# EAGLE design T14_V2_METROKNOME (EAGLE 6.1)
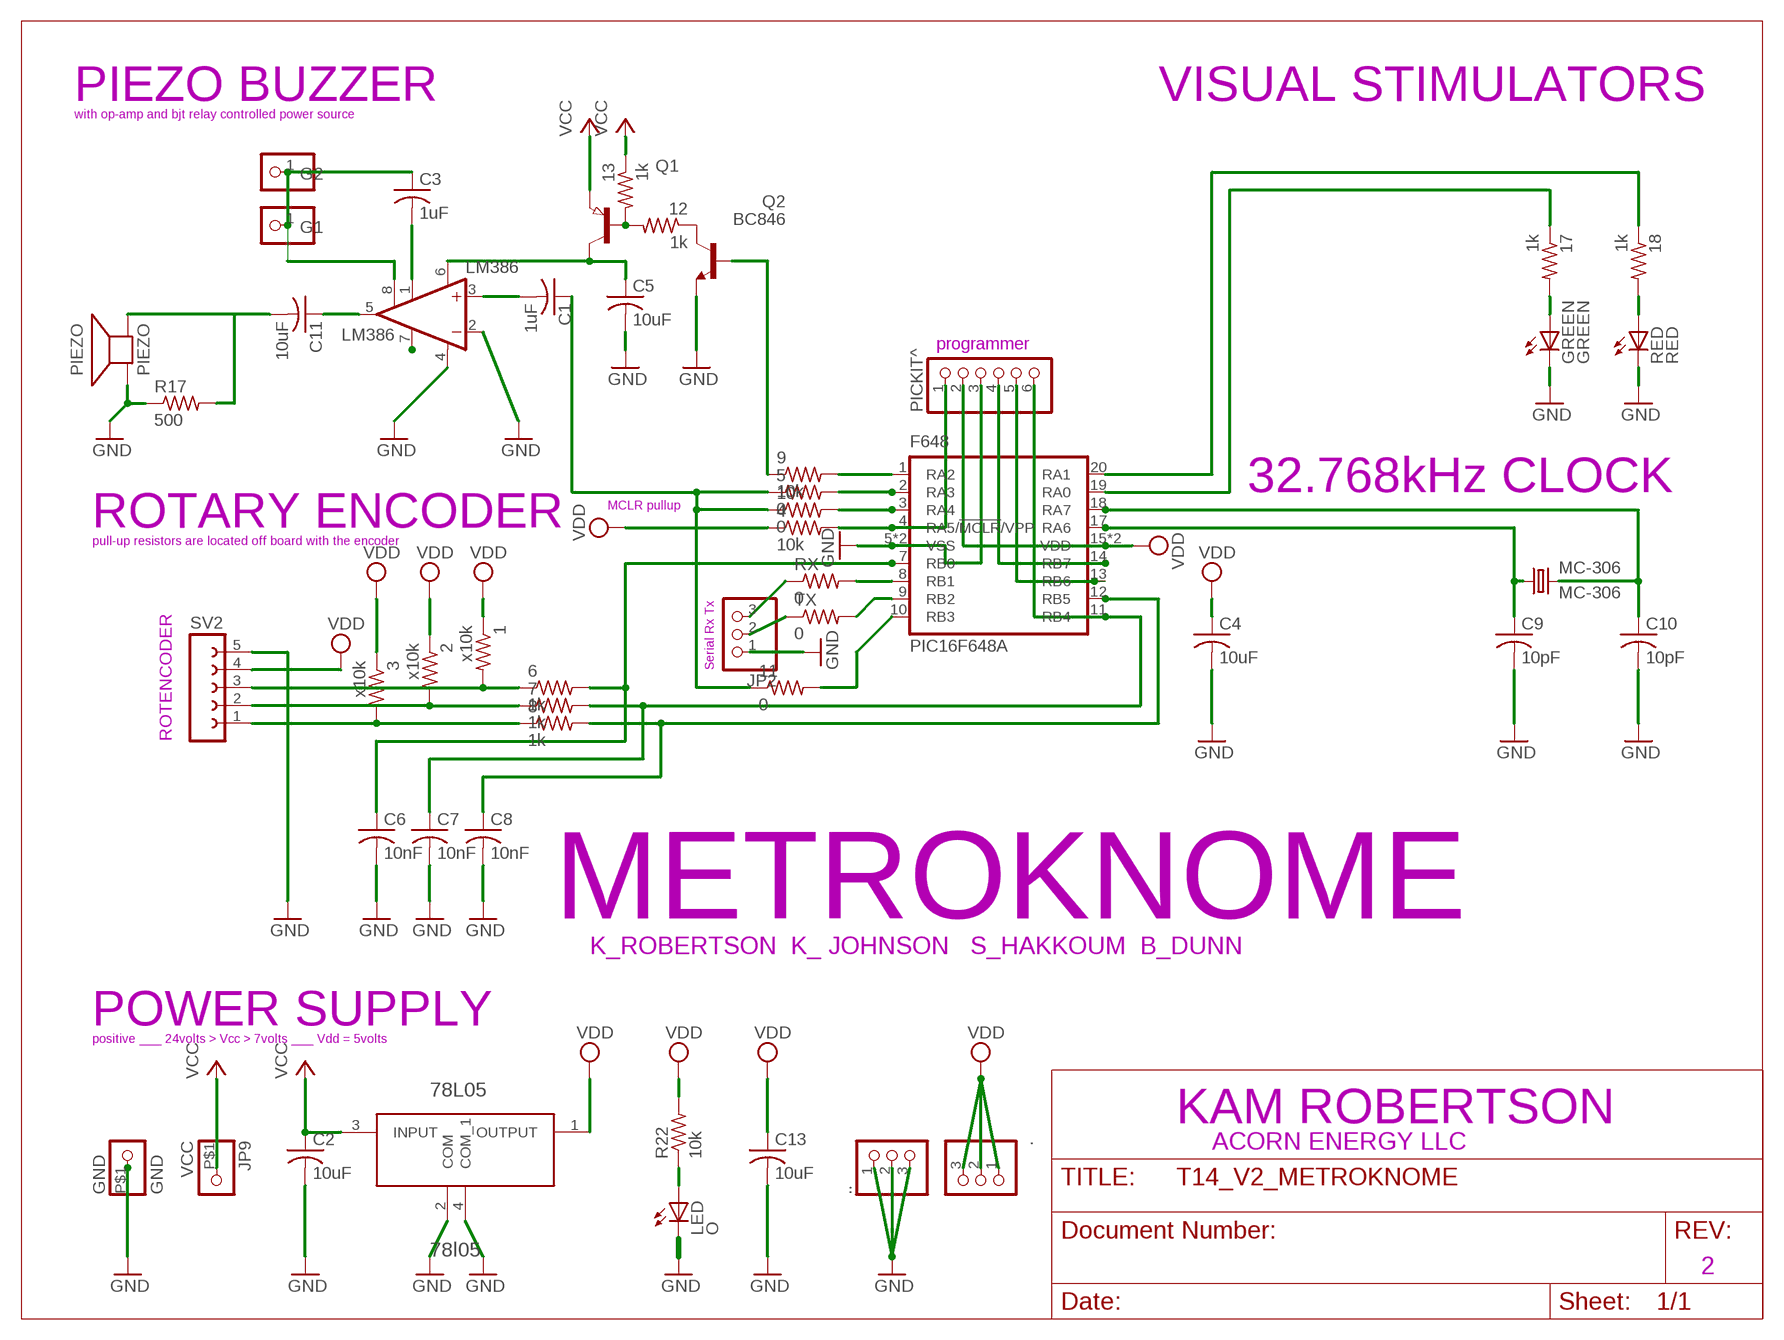
[diagram p0: schematic, sheet 1]

## Parts
1  x10k  R-US_R0603  [R0603]
2  x10k  R-US_R0603  [R0603]
3  x10k  R-US_R0603  [R0603]
4  10k  R-US_R1206  [R1206]
5  0  R-US_R0603  [R0603]
6  1k  R-US_R1206  [R1206]
7  1k  R-US_R1206  [R1206]
8  1k  R-US_R1206  [R1206]
9  10k  R-US_R1206  [R1206]
10  0  R-US_R0603  [R0603]
11  0  R-US_R1206  [R1206]
12  1k  R-US_R1206  [R1206]
13  1k  R-US_R1206  [R1206]
17  1k  R-US_R1206  [R1206]
18  1k  R-US_R1206  [R1206]
78L05  78l05  UA78L05ACPKG3  [SOT150P400X160-4N]
.  PINHD-1X3CB  [1X03-CLEANBIG]
..  PINHD-1X3CB  [1X03-CLEANBIG]
C1  1uF  C-USC1210  [C1210]
C2  10uF  C-USC1210  [C1210]
C3  1uF  C-USC1210  [C1210]
C4  10uF  C-USC1210  [C1210]
C5  10uF  C-USC1210  [C1210]
C6  10nF  C-USC1210  [C1210]
C7  10nF  C-USC1210  [C1210]
C8  10nF  C-USC1210  [C1210]
C9  10pF  C-USC1210  [C1210]
C10  10pF  C-USC1210  [C1210]
C11  10uF  C-USC1210  [C1210]
C13  10uF  C-USC1210  [C1210]
F648  PIC16F648A  PIC16F1826/27SS  [SSOP20]
G1  PINHD-1X1CB  [1X01-CLEANBIG]
G2  PINHD-1X1CB  [1X01-CLEANBIG]
GND  GND  PINHD-1X1-BIGPOGO  [1X1-BIGPOGO]
GREEN  GREEN  LED5MM  [LED5MM]
JP2  PINHD-1X3CB  [1X03-CLEANBIG]
JP9  VCC  PINHD-1X1-BIGPOGO  [1X1-BIGPOGO]
LED  O  LEDCHIPLED_1206  [CHIPLED_1206]
LM386  LM386  LM386M-1  [SO08]
MC-306  MC-306  [MC-306]
PICKIT^  PINHD-1X6LOCK  [1X06-BIGLOCK]
PIEZO  PIEZO  SPEAKER/PS12  [PS12]
Q1  PNP-TRANSISTOR_SOT89  [SOT89]
Q2  BC846  [SOT23]
R17  500  R-US_R1206  [R1206]
R22  10k  R-US_R1206  [R1206]
RED  RED  LED5MM  [LED5MM]
RX  0  R-US_R1206  [R1206]
SV2  FE05-1  [FE05-1]
TX  0  R-US_R1206  [R1206]

## Nets
GND: 78L05.2(COM) 78L05.4(COM_1) ...1 ...2 ...3 C2.2 C4.2 C5.2 C6.2 C7.2 C8.2 C9.2 C10.2 C13.2 F648.5(VSS) F648.6(VSS) GND.P$1 GREEN.K(C) JP2.1 LED.C LM386.2(-IN) LM386.4(GND) PICKIT^.3 PIEZO.P$2(-) Q2.2(E) R17.1 RED.K(C) SV2.5
N$1: 9.2 F648.1(RA2)
N$2: C3.2 LM386.1(GAIN)
N$3: 9.1 Q2.1(B)
N$4: 5.2 F648.2(RA3)
N$5: 4.2 F648.4(RA5/!MCLR!/VPP) PICKIT^.1
N$6: 6.2 C6.1 F648.7(RB0)
N$7: JP2.3 RX.1
N$8: 8.2 C8.1 F648.12(RB5)
N$9: 10.2 F648.3(RA4)
N$10: 11.2 F648.10(RB3)
N$11: 12.1 Q2.3(C)
N$12: 12.2 13.2 Q1.1(B)
N$13: C3.1 G1.1 G2.1 LM386.8(GAIN)
N$14: 1.2 6.1 SV2.3
N$15: 2.2 7.1 SV2.2
N$16: 3.2 8.1 SV2.1
N$17: JP2.2 TX.1
N$18: 17.1 F648.19(RA0)
N$19: 18.1 F648.20(RA1)
N$20: 7.2 C7.1 F648.11(RB4) PICKIT^.6
N$21: F648.9(RB2) TX.2
N$22: F648.14(RB7) PICKIT^.4
N$23: F648.8(RB1) RX.2
N$24: F648.13(RB6) PICKIT^.5
N$28: 18.2 RED.A
N$29: 17.2 GREEN.A
N$31: C9.1 F648.17(RA6) MC-306.1
N$35: C1.2 LM386.3(+IN)
N$36: C11.1 LM386.5(OUT)
N$37: C10.1 F648.18(RA7) MC-306.4
N$39: C11.2 PIEZO.P$1(+) R17.2
N$40: LED.A R22.1
N$85: 5.1 10.1 11.1 C1.1
N$102: LM386.7(BYPASS)
VCC: 13.1 78L05.3(INPUT) C2.1 JP9.P$1 Q1.3(E)
VDD: 1.1 2.1 3.1 4.1 78L05.1(OUTPUT) ..1 ..2 ..3 C4.1 C13.1 F648.15(VDD) F648.16(VDD) PICKIT^.2 R22.2 SV2.4
VS: C5.1 LM386.6(VS) Q1.2(C)

## Notes on the sheet
- PIEZO BUZZER | VISUAL STIMULATORS
- with op-amp and bjt relay controlled power source
- programmer
- 32.768kHz CLOCK
- MCLR pullup
- ROTARY ENCODER
- pull-up resistors are located off board with the encoder
- Serial Rx Tx
- ROTENCODER
- METROKNOME
- K_ROBERTSON  K_ JOHNSON   S_HAKKOUM  B_DUNN
- POWER SUPPLY
- positive ___ 24volts > Vcc > 7volts ___ Vdd = 5volts
- KAM ROBERTSON
- ACORN ENERGY LLC
- 2

## Library data of the parts
1-13 17 18 R17 R22 RX TX = resistor:R-US_: RESISTOR, American symbol
78L05 = TI-Eagle_library:UA78L05: μA78L00 SERIES POSITIVE-VOLTAGE REGULATORS,SOT-89-3; MPN: UA78L05ACPKG3; OC_FARNELL: 1236590; OC_NEWARK: 13M5626; PACKAGE: SOT-89-3; SUPPLIER: TEXAS INSTRUMENTS
. .. JP2 = adafruit:PINHD-1X3: PIN HEADER
C1-C11 C13 = adafruit:C-US: CAPACITOR, American symbol
F648 = microchip:PIC16*F1826/27: 18/20/28-Pin Flash Microcontrollers with nanoWatt XLP Technology Source: www.microchip.com PIC16F1827.pdf
G1 G2 GND JP9 = adafruit:PINHD-1X1: Pin header 1x1 for 0.1" spacing With round pins
GREEN LED RED = adafruit:LED: LED OSRAM: - CHIPLED LG R971, LG N971, LY N971, LG Q971, LY Q971, LO R971, LY R971 LH N974, LH R974 LS Q976, LO Q976, LY Q976 LO Q996 - Hyper CHIPLED LW Q18S LB Q993, LB Q99A, LB R99A - SideLED LS A670, LO A670, LY A670, LG A670, LP A670 LB A673, LV A673, LT A673, LW A673 LH A674 LY A675 LS A676, LA A676, LO A676, LY A676, LW A676 LS A679, LY A679, LG A679 - Hyper Micro SIDELED® LS Y876, LA Y876, LO Y876, LY Y876 LT Y87S - SmartLED LW L88C, LW L88S LB L89C, LB L89S, LG L890 LS L89K, LO L89K, LY L89K LS L896, LA L896, LO L896, LY L896 - TOPLED LS T670, LO T670, LY T670, LG T670, LP T670 LSG T670, LSP T670, LSY T670, LOP T670, LYG T670 LG T671, LOG T671, LSG T671 LB T673, LV T673, LT T673, LW T673 LH T674 LS T676, LA T676, LO T676, LY T676, LB T676, LH T676, LSB T676, LW T676 LB T67C, LV T67C, LT T67C, LS T67K, LO T67K, LY T67K, LW E67C LS E67B, LA E67B, LO E67B, LY E67B, LB E67C, LV E67C, LT E67C LW T67C LS T679, LY T679, LG T679 LS T770, LO T770, LY T770, LG T770, LP T770 LB T773, LV T773, LT T773, LW T773 LH T774 LS E675, LA E675, LY E675, LS T675 LS T776, LA T776, LO T776, LY T776, LB T776 LHGB T686 LT T68C, LB T68C - Hyper Mini TOPLED® LB M676 - Mini TOPLED Santana® LG M470 LS M47K, LO M47K, LY M47K Source: http://www.osram.convergy.de/
LM386 = linear:LM386?-*: Low Voltage Audio Power Amplifier Source: http://cache.national.com/ds/LM/LM386.pdf
MC-306 = crystal:MC-306: kHz RANGE CRYSTAL UNIT SMD Source: MC-306_405_406_E07X.PDF Homepage <http://www.epsontoyocom.co.jp>; MPN: MC-306 60.0KHZ 100PPM ,12.5PF; OC_FARNELL: 1278040; OC_NEWARK: 31M5576
PICKIT^ = adafruit:PINHD-1X6: PIN HEADER
PIEZO = adafruit:SPEAKER: SPEAKER Source: Buerklin Added PS12 (for part # PS1240 piezo) http://www.ladyada.net/library/pcb/eaglelibrary.html
Q1 = semicon-smd-ipc:PNP-TRANSISTOR_: PNP TRANSISTOR
Q2 = transistor-neu-to92:BC846: NPN TRANSISTOR
SV2 = con-lsta:FE05-1: FEMALE HEADER; OC_FARNELL: unknown; OC_NEWARK: unknown

## Board
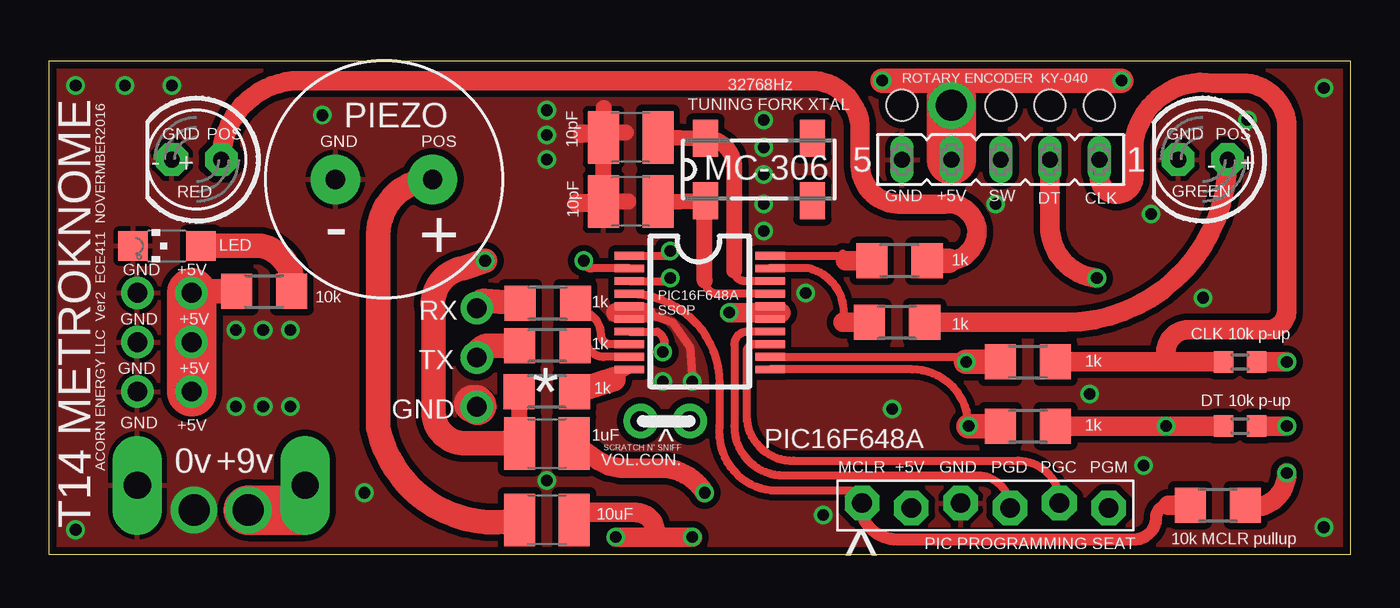
[diagram p1: board, top side]
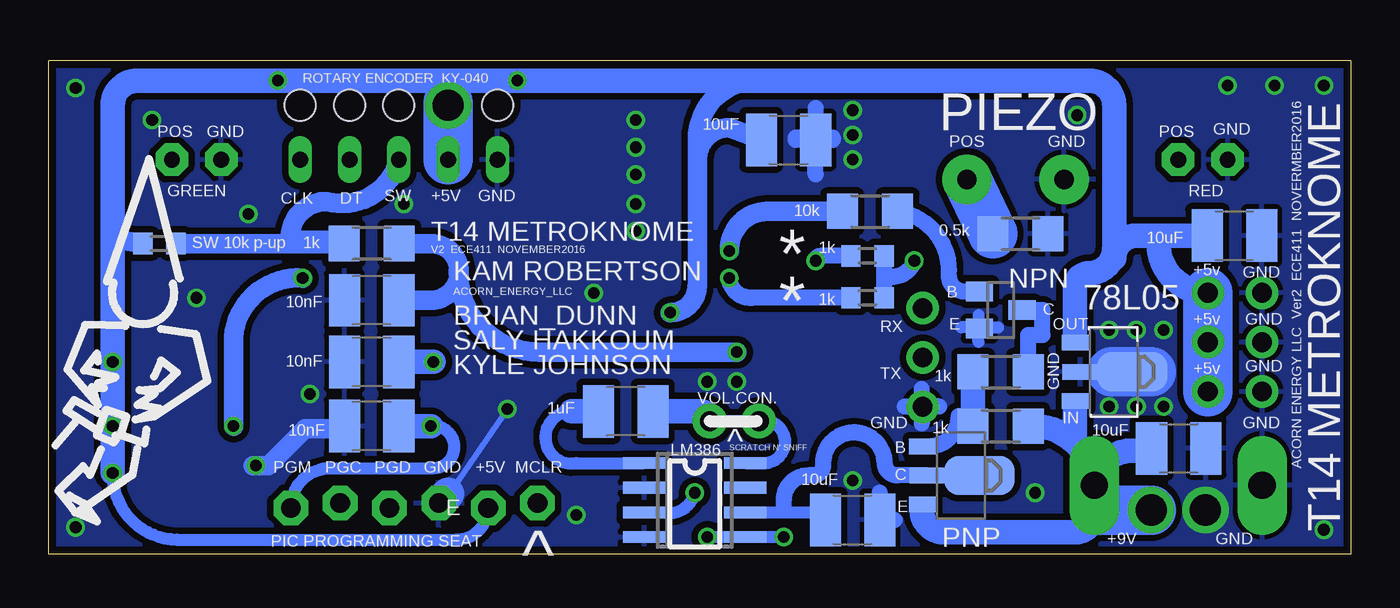
[diagram p2: board, bottom side, seen from below]

Size 67.06 x 25.4 mm. Coordinates in mm from the lower left corner, seen from the top.
Outline: 0,0 0,25.4 67.06,25.4 67.06,0 0.01,0
Copper layers (1*16): Top 0.0356mm / dielectric 1.5011mm / Bottom 0.0356mm
Design rules: minimum track width 13mil, minimum drill 13mil, track to track 13mil, track to pad 13mil, pad to pad 13mil, via to via 13mil, smd to smd 13mil, copper to edge 15mil, drill to drill 6mil, minimum pad ring 7mil, minimum via ring 7mil, stop-mask expansion 2.5mil, vias tented up to drill 0mil, thermal gap 10mil
Holes 1.6 mm at 49.02,23.11 51.56,23.11 54.1,23.11 43.94,23.11

### Footprints (pad centres in the part's own frame; a part is rotated, then mirrored left to right if it is on the bottom)
R0603 = smd 1 x 1.1: 1 -0.85,0; 2 0.85,0
R1206 = smd 1.6 x 1.803: 1 -1.422,0; 2 1.422,0
SOT150P400X160-4N = smd 0.8 x 1.4: 1 -1.499,-1.981; 3 1.499,-1.981 | smd 0.8 x 1.9: 2 0,-1.727 | smd 2.032 x 3.65: 4 0,0.94
1X03-CLEANBIG = drill 1.016 pad 1.676: 1 -2.54,0; 2 0,0; 3 2.54,0
C1210 = smd 1.6 x 2.7: 1 -1.4,0; 2 1.4,0
SSOP20 = smd 0.4 x 1.5: 1 -2.925,-3.625; 2 -2.275,-3.625; 3 -1.625,-3.625; 4 -0.975,-3.625; 5 -0.325,-3.625; 6 0.325,-3.625; 7 0.975,-3.625; 8 1.625,-3.625; 9 2.275,-3.625; 10 2.925,-3.625; 11 2.925,3.625; 12 2.275,3.625; 13 1.625,3.625; 14 0.975,3.625; 15 0.325,3.625; 16 -0.325,3.625; 17 -0.975,3.625; 18 -1.625,3.625; 19 -2.275,3.625; 20 -2.925,3.625
1X01-CLEANBIG = drill 1.016 pad 1.778: 1 0,0
1X1-BIGPOGO = drill 1.4 pad 2.54 long: P$1 0,0
LED5MM = drill 0.813 pad 1.676 octagon: A -1.27,0; K 1.27,0
CHIPLED_1206 = smd 1.5 x 1.5: A 0,-1.75; C 0,1.75
SO08 = smd 0.6 x 2.2: 1 -1.905,-2.6; 2 -0.635,-2.6; 3 0.635,-2.6; 4 1.905,-2.6; 5 1.905,2.6; 6 0.635,2.6; 7 -0.635,2.6; 8 -1.905,2.6
MC-306 = smd 1.3 x 1.9: 1 -2.75,-1.6; 2 2.75,-1.6; 3 2.75,1.6; 4 -2.75,1.6
1X06-BIGLOCK = drill 1.016 pad 1.778 octagon: 1 -6.35,0.127; 2 -3.81,-0.127; 3 -1.27,0.127; 4 1.27,-0.127; 5 3.81,0.127; 6 6.35,-0.127
PS12 = drill 1 pad 2.54: P$1 -2.5,0; P$2 2.5,0
SOT89 = smd 0.8 x 1.4: 1 -1.499,-1.981; 3 1.499,-1.981 | smd 0.8 x 1.9: 2 0,-1.727 | smd 2.032 x 3.65: 2@1 0,0.94
SOT23 = smd 1 x 1.4: 1 -0.95,-1.1; 2 0.95,-1.1; 3 0,1.1
FE05-1 = drill 0.813 long: 1 -5.08,0; 2 -2.54,0; 3 0,0; 4 2.54,0; 5 5.08,0

### Placement (x,y rotation side)
1  61.34,16 0 bottom
2  61.34,6.6 180 top
3  61.34,9.91 180 top
4  60.2,2.54 180 top
5  24.89,15.37 180 bottom
6  50.42,16 0 bottom
7  50.42,6.6 180 top
8  50.42,9.91 180 top
9  24.77,17.65 180 bottom
10  24.89,13.21 180 bottom
11  25.65,8.38 0 top
12  18.03,9.4 180 bottom
13  18.03,6.6 180 bottom
17  43.69,11.94 0 top
18  43.81,15.11 0 top
78L05  12.19,9.4 270 bottom
.  7.37,10.92 90 top
..  4.57,10.92 270 top
C1  25.65,5.71 0 top
C2  8.86,5.46 0 bottom
C3  37.34,7.37 180 bottom
C4  28.96,21.34 0 bottom
C5  25.65,1.78 0 bottom
C6  50.42,13.08 180 bottom
C7  50.42,6.6 180 bottom
C8  50.42,9.91 180 bottom
C9  29.97,18.16 180 top
C10  29.97,21.46 180 top
C11  25.65,1.78 180 top
C13  5.99,16.41 0 bottom
F648  33.53,12.45 270 top
G1  33.02,6.86 180 bottom
G2  30.48,6.86 180 bottom
GND  4.57,3.56 270 bottom
GREEN  59.44,20.32 180 top
JP2  22.05,10.13 90 top
JP9  13.21,3.56 90 bottom
LED  6.1,15.88 90 top
LM386  33.78,2.79 270 bottom
MC-306  36.58,19.81 0 top
PICKIT^  48.23,2.51 0 top
PIEZO  17.27,19.3 180 top
Q1  20.07,4.06 270 bottom
Q2  18.03,12.57 270 bottom
R17  17.02,16.51 180 bottom
R22  11.1,13.54 180 top
RED  7.62,20.32 180 top
RX  25.7,12.93 0 top
SV2  49.02,20.32 180 top
TX  25.68,10.74 0 top

### Tracks (layer width: path | path; a pad name or v marks a point on that pad's centre or on a via)
GND  (via drill 0.6, 1.6)
  Top 0.254: 29.58,12.45 arc90 F648.6
  Top 0.406: 29.58,12.45 arc90 F648.5 | 30.73,12.45 32.13,11.94 33.02,10.67 v33.15,8.89
  Top 0.813: 28.57,22.99 28.57,21.59 | C9.2 28.57,18.03 27.18,18.03 27.18,18.16 C9.2 | 29.84,18.16 C9.2 | C9.2 28.57,21.59 | 28.57,21.59 27.43,21.59 27.43,21.72 29.72,21.72
  Top 1.016: 29.21,12.45 29.58,12.45 30.73,12.45
  Top 1.93: 22.1,7.62 arc90 21.97,7.75 21.84,7.75
  Bottom 0.305: v43.43,7.49 46.48,3.05
  Bottom 0.61: 19.18,12.32 19.18,11.68 | 19.18,10.92 19.18,11.68 | 19.18,11.68 20.07,11.68 | 19.18,11.68 18.16,11.68 | 46.48,3.05 arc291 46.48,3.12
  Bottom 0.813: 27.56,22.99 C4.2 | 27.56,19.56 C4.2 | C4.2 28.57,21.34 C10.2 26.67,21.46 26.67,21.34 | 22.99,7.62 22.1,7.62 | 21.21,7.62 22.1,7.62 | 22.1,7.62 22.1,8.51 | 22.1,7.62 22.1,6.73 | 23.5,1.78 C5.2 24.26,3.17 | JP2.1 22.1,7.62
  Bottom 1.016: Q2.2 arc90 19.18,11.67 19.18,11.68 | C7.2 51.95,6.48 53.85,6.48 55.75,4.57 v56.39,4.57 56.52,4.57
  Bottom 1.676: PICKIT^.3 46.48,3.12 46.99,2.67
  Bottom 2.54: 10.29,9.4 12.32,9.4
  other vias: 65.66,1.4 65.66,24 1.4,1.27 1.4,24.13 61.72,22.35 6.35,24.13 53.59,8.26 39.88,2.03 59.44,13.21 36.83,16.64 36.83,18.03 36.83,19.56 36.83,20.95 36.83,22.35 56.77,17.53 38.99,13.46 14.1,22.61 25.65,22.86 25.65,21.59 25.65,20.32 11.05,11.56 9.65,11.56 12.45,11.56 9.65,7.62 11.05,7.62 12.45,7.62 31.62,8.89 16.26,3.17 25.65,3.81 48.77,18.03 3.94,24.13 7.49,2.29
  pour Top: 0.38,25.15 0.38,0.25 66.8,0.25 66.8,25.15
  pour Bottom: 0.38,25.02 0.38,0.13 66.8,0.25 66.8,25.15
N$1  (via drill 0.6)
  Top 0.406: F648.1 31.63,15.37 arc90 v32,15.62
  Bottom 1.016: 26.16,17.65 9.2 30.1,17.65 arc-90 v32,15.62
N$2
  Bottom 0.61: 40.13,7.37 arc-191 39.88,4.7 LM386.1
  Bottom 1.27: C3.2 40.13,7.37
N$3
  Bottom 0.813: Q2.1 19.87,13.52 arc90 20.7,14.35 arc-90 23.5,17.65 9.1
N$4  (via drill 0.6)
  Top 0.406: F648.2 27.95,14.72 arc-90 v27.56,15.11
  Bottom 0.813: 5.2 27.3,15.37 arc-90 v27.56,15.11
N$5
  Top 0.406: F648.4 arc-90 34.54,8.78 34.54,6.6 arc90 37.21,3.3 41.15,3.3 arc-90 41.78,2.67 arc90 41.81,2.64 PICKIT^.1
  Top 0.61: 57.66,2.54 arc90 57.02,1.91 arc-90 55.88,0.76 43.69,0.76 arc-90 41.78,2.67
  Top 1.016: 4.2 57.66,2.54
N$6  (via drill 0.6)
  Top 0.406: F648.7 31.33,11.47 arc-90 v31.62,10.41
  Bottom 0.254: 45.97,14.61 arc-90 47.37,16
  Bottom 1.016: 6.2 47.37,16 arc180 47.37,13.08 C6.1 | v31.62,10.41 41.78,10.41 arc90 45.97,14.61
N$7
  Top 1.27: RX.1 22.45,13.06 arc90 22.1,12.7 22.1,12.62 | 22.1,12.57 22.1,12.62 | 22.1,12.62 arc90 JP2.3
N$8  (via drill 0.6)
  Top 0.406: v47.24,9.91 46.99,10.16 37.21,10.16 37.2,10.17 F648.12
  Top 1.27: 8.2 v47.24,9.91
  Bottom 1.27: v47.24,9.91 C8.1
N$9  (via drill 0.6)
  Top 0.406: F648.3 31.72,14.07 arc90 v32,14.22
  Bottom 0.813: 25.78,13.21 10.2 30.86,13.21 arc90 v32,14.22
N$10
  Top 0.406: 29.08,9.02 F648.10
  Top 1.27: 11.2 29.08,9.02
N$11
  Bottom 0.813: 12.1 16.61,11.3 15.88,11.3 15.88,12.57 16.89,12.57
  Bottom 1.016: Q2.3 16.89,12.57
N$12
  Bottom 0.406: 13.2 19.43,6.6
  Bottom 0.813: Q1.1 21.74,5.56 arc-90 20.19,7.11 19.94,7.11 | 19.94,7.11 arc90 19.43,6.6 | 19.94,7.11 19.46,7.11
  Bottom 1.27: 19.46,7.11 12.2
N$13
  Top 0.61: G1.1 30.61,6.86
  Bottom 0.61: G1.1 G2.1 arc193 30.23,4.7 LM386.8
  Bottom 1.27: C3.1 33.53,7.37 arc90 G1.1
N$14
  Bottom 0.61: 54.61,16.38 52.09,16.38 arc90 6.1
  Bottom 1.016: 1.2 6.1 | 54.61,16.38 arc90 52.7,18.16 arc-90 SV2.3
N$15  (via drill 0.6)
  Top 1.016: 2.2 v57.53,6.6 7.1 | 7.1 51.82,6.6 arc-90 51.94,6.48 51.94,6.5 arc90 7.1 | SV2.2 51.56,17.14 arc90 v53.98,14.22
  Bottom 1.016: v53.98,14.22 arc-90 57.53,11.18 v57.53,6.6
N$16
  Top 1.016: 3.2 57.53,9.91 | 57.53,9.91 8.1 | 57.53,9.91 57.53,10.41 arc-90 58.67,11.56 62.74,11.56 arc90 63.75,12.57 63.75,21.97 arc90 61.47,24.26 59.94,24.26 arc90 55.88,21.21 55.88,19.43 arc-180 54.1,19.43 SV2.1
N$17
  Top 1.27: TX.1 22.66,10.74 arc90 JP2.2
N$18
  Top 0.406: 40.89,11.94 arc90 39.12,14.73 37.16,14.73 arc90 F648.19
  Top 1.016: 17.1 40.89,11.94
N$19
  Top 0.406: F648.20 arc90 F648.20 40.64,15.37 arc90 41.02,15.11 40.89,15.49
  Top 1.016: 18.1 41.02,15.11
N$20  (via drill 0.6)
  Top 0.406: v47.37,6.6 arc90 44.45,9.52 F648.11
  Top 1.27: v47.37,6.6 7.2
  Bottom 0.61: PICKIT^.6 arc90 52.53,4.45 47.24,4.45 arc-187 v47.37,6.6
  Bottom 1.27: C7.1 v47.37,6.6
N$21
  Top 0.406: F648.9 28.56,10.17 arc-90 27.69,11.05 27.41,11.05 arc90 TX.2
N$22
  Top 0.406: PICKIT^.4 arc90 47.83,4.06 37.85,4.06 arc-90 35.31,6.6 35.31,10.79 arc-90 35.98,11.47 F648.14
N$23
  Top 0.406: 27.18,12.57 arc-90 28.45,11.3 arc90 28.93,10.82 F648.8 | 27.18,12.57 27.18,12.45 | 27.18,12.57 27.15,12.57 arc90 RX.2
N$24
  Top 0.406: F648.13 36.35,10.82 arc90 35.94,10.41 35.94,7.11 arc90 38.35,4.83 49.91,4.83 arc-90 52.07,2.67 | 52.07,2.67 52.07,2.54 | 52.07,2.67 arc90 PICKIT^.5
N$28
  Top 1.016: RED.A arc-90 12.95,24.38 39.24,24.38 arc-90 41.78,21.84 41.78,20.07 arc90 43.81,18.03 46.1,18.03 arc-188 46.35,15.11
  Top 1.27: 18.2 46.35,15.11
N$29
  Top 1.016: 17.2 52.32,11.94 arc90 GREEN.A
N$31
  Top 0.406: F648.17 34.46,13.42 arc-90 33.78,14.1 | MC-306.1 MC-306.1 arc-90 33.78,18.16
  Top 0.813: 33.78,14.1 33.78,18.16 | C9.1 MC-306.1
N$35  (via drill 0.6)
  Top 0.61: C1.2
  Top 1.016: v33.78,3.17 arc61 31.37,4.45 29.46,4.45 28.83,4.57 28.32,4.83 C1.2
  Bottom 0.61: LM386.3 35.43,2.16 arc-90 v33.78,3.17
N$36  (via drill 0.6)
  Top 0.61: C11.1 arc-90 27.43,2.16 | 31.24,1.14 31.24,0.89
  Top 1.016: v29.21,0.89 31.24,0.89 v33.15,0.89 | 27.43,2.16 30.23,2.16 arc-90 31.24,1.14
  Bottom 0.61: LM386.5 v33.15,0.89 | v29.21,0.89 31.11,0.89
N$37
  Top 0.406: F648.18 35.84,14.07 arc-90 35.31,14.61
  Top 0.813: 35.31,14.61 35.31,19.93 arc90 MC-306.4 C10.1
N$39
  Top 1.27: C11.2 arc-90 16.98,6.51 16.98,16.47 arc-90 19.81,19.3 PIEZO.P$1
  Bottom 2.54: R17.2 PIEZO.P$1
N$40
  Top 1.27: R22.1 arc90 10.95,15.88 LED.A
N$85  (via drill 0.6)
  Top 0.813: 24.25,7.62 C1.1 24.25,5.58 arc-90 24.26,5.59 arc90 24.13,5.71 | 24.25,7.62 24.25,7.74 arc-90 24.26,7.75 | 11.1 24.23,7.64 arc90 24.25,7.62
  Top 1.27: v22.48,15.11 21.34,14.73 arc90 19.81,12.57 19.81,7.37 arc90 21.46,5.71 24.13,5.71
  Bottom 0.61: 10.1 24.04,13.04 arc-90 24,12.95 24,14.35
  Bottom 0.813: 5.1 10.1 | v22.48,15.11 arc90 24,14.35
VCC  (via drill 1.6)
  Top 2.54: v10.29,2.29 13.21,2.29 13.21,2.41
  Bottom 0.406: 13.08,5.08 arc-90 13.21,4.95 13.21,2.67
  Bottom 0.813: Q1.3 22.05,2.21 arc90 22.1,2.16 | 78L05.3 14.17,7.54 arc90 14.22,7.49
  Bottom 1.016: 10.29,5.33 arc-90 10.27,5.36 C2.1
  Bottom 1.27: 22.1,2.16 arc-90 20.83,1.14 14.35,1.14 arc-90 13.21,2.03 13.21,2.54 13.21,2.67 JP9.P$1 | JP9.P$1 arc90 11.18,5.33 10.29,5.33 | 13.1 16.51,6.6 arc90 JP9.P$1 | 14.22,7.49 14.22,6.22 arc-90 13.08,5.08
  Bottom 2.54: v10.29,2.29 13.21,2.29 13.21,2.54
VDD  (via drill 0.6, 1.6)
  Top 0.406: 37.72,12.45 arc90 37.39,12.77 F648.16 F648.15
  Top 1.016: 37.72,12.45 v35.05,12.45 | 3.1 v63.75,9.91 | 2.1 v63.75,6.6 | 4.1 61.98,2.41 arc90 v63.75,4.19
  Top 1.27: R22.2 7.44,13.54 arc90 ..3 | v42.93,24.38 v55.24,24.38
  Top 2.54: ..3 ..2 ..1 | SV2.4 46.48,23.5
  Bottom 0.406: 12.19,15.24 12.19,15.75
  Bottom 0.61: v63.75,4.19 arc-90 60.45,0.76 46.05,0.76 arc-90 PICKIT^.2 | SV2.4 arc-90 45.97,20.83 45.97,24.38 45.97,24.64 | v42.93,24.38 45.97,24.64 | v55.24,24.38 45.97,24.64
  Bottom 0.813: 78L05.1 14.17,11.12 arc-90 14.22,11.18 | 46.48,23.24 arc90 46.99,23.75
  Bottom 1.016: v35.05,12.45 arc-90 33.66,13.84 33.66,20.32 | 33.66,20.32 33.66,21.34 arc90 30.61,24.38 | C4.1 32,21.97 arc-90 33.66,20.32 | 1.1 63.75,16.26
  Bottom 1.27: 14.22,11.18 14.22,13.72 arc90 13.46,14.48 arc-90 12.19,15.75 12.19,23.11 arc-90 13.46,24.38 30.61,24.38 45.97,24.38 62.48,24.38 arc-90 63.75,23.11 63.75,16.26 v63.75,9.91 v63.75,6.6 v63.75,4.19 | C13.1 9.91,16.41 | 9.91,16.41 11.02,16.41 arc-90 12.19,15.24 | ..3 arc90 9.91,16 9.91,16.41
  Bottom 2.54: ..3 ..1 | SV2.4 v46.48,23.11 46.48,23.24
VS
  Bottom 0.254: 29.21,2.41 29.21,2.16
  Bottom 0.305: LM386.6 31.11,2.16
  Bottom 0.61: 31.11,2.16 29.21,2.16 27.56,2.16 arc90 27.05,1.65 arc90 27.05,1.65 C5.1
  Bottom 0.813: Q1.2 23.37,4.06 arc90 24,4.7 arc-184 27.18,4.57 arc90 27.69,4.06 27.94,4.06 arc-90 29.21,2.79 29.21,2.41

### Text on the board
tPlace: 32768Hz | ROTARY ENCODER KY-040 | T14 METROKNOME | ACORN ENERGY LLC Ver2 ECE411 NOVERMBER2016 | TUNING FORK XTAL | GND | POS | GND | POS | 10pF | GND | POS | - | + | - | + | GND | +5V | SW | DT | CLK | 10pF | LED | - | + | 1k | GND | +5V | 10k | 1k | PIC16F648A | GND | +5V | RX | SSOP | 1k | 1k | CLK 10k p-up | TX | 1k | GND | +5V | 1k | DT 10k p-up | GND | * | GND | +5V | 1uF | 1k | VOL.CON. | SCRATCH N' SNIFF | ^ | PIC16F648A | 0v | +9v | MCLR | +5V | GND | PGD | PGC | PGM | 10uF | ^ | 10k MCLR pullup | PIC PROGRAMMING SEAT
bPlace: ROTARY ENCODER KY-040 | T14 METROKNOME | ACORN ENERGY LLC Ver2 ECE411 NOVERMBER2016 | GND | PIEZO | 10uF | POS | GND | POS | GND | POS | RED | GND | +5V | SW | DT | CLK | GREEN | 10k | 10uF | 0.5k | T14 METROKNOME | 1k | SW 10k p-up | 1k | V2 ECE411 NOVEMBER2016 | GND | +5v | NPN | * | KAM ROBERTSON | B | 1k | ACORN_ENERGY_LLC | 10nF | GND | +5v | OUT | C | E | * | BRIAN_DUNN | RX | SALY HAKKOUM | GND | 10nF | GND | +5v | 1k | TX | KYLE JOHNSON | VOL.CON. | IN | 1uF | GND | 10uF | 1k | GND | 10nF | B | SCRATCH N' SNIFF | ^ | LM386 | C | 10uF | MCLR | +5V | GND | PGD | PGC | PGM | E | E | GND | +9V | PNP | ^ | PIC PROGRAMMING SEAT
Notes: HERBERT_THE_ROOSTER